# EAGLE design Trimble Thunderbolt Monitor Shield v1.1 (EAGLE 6.5.0)
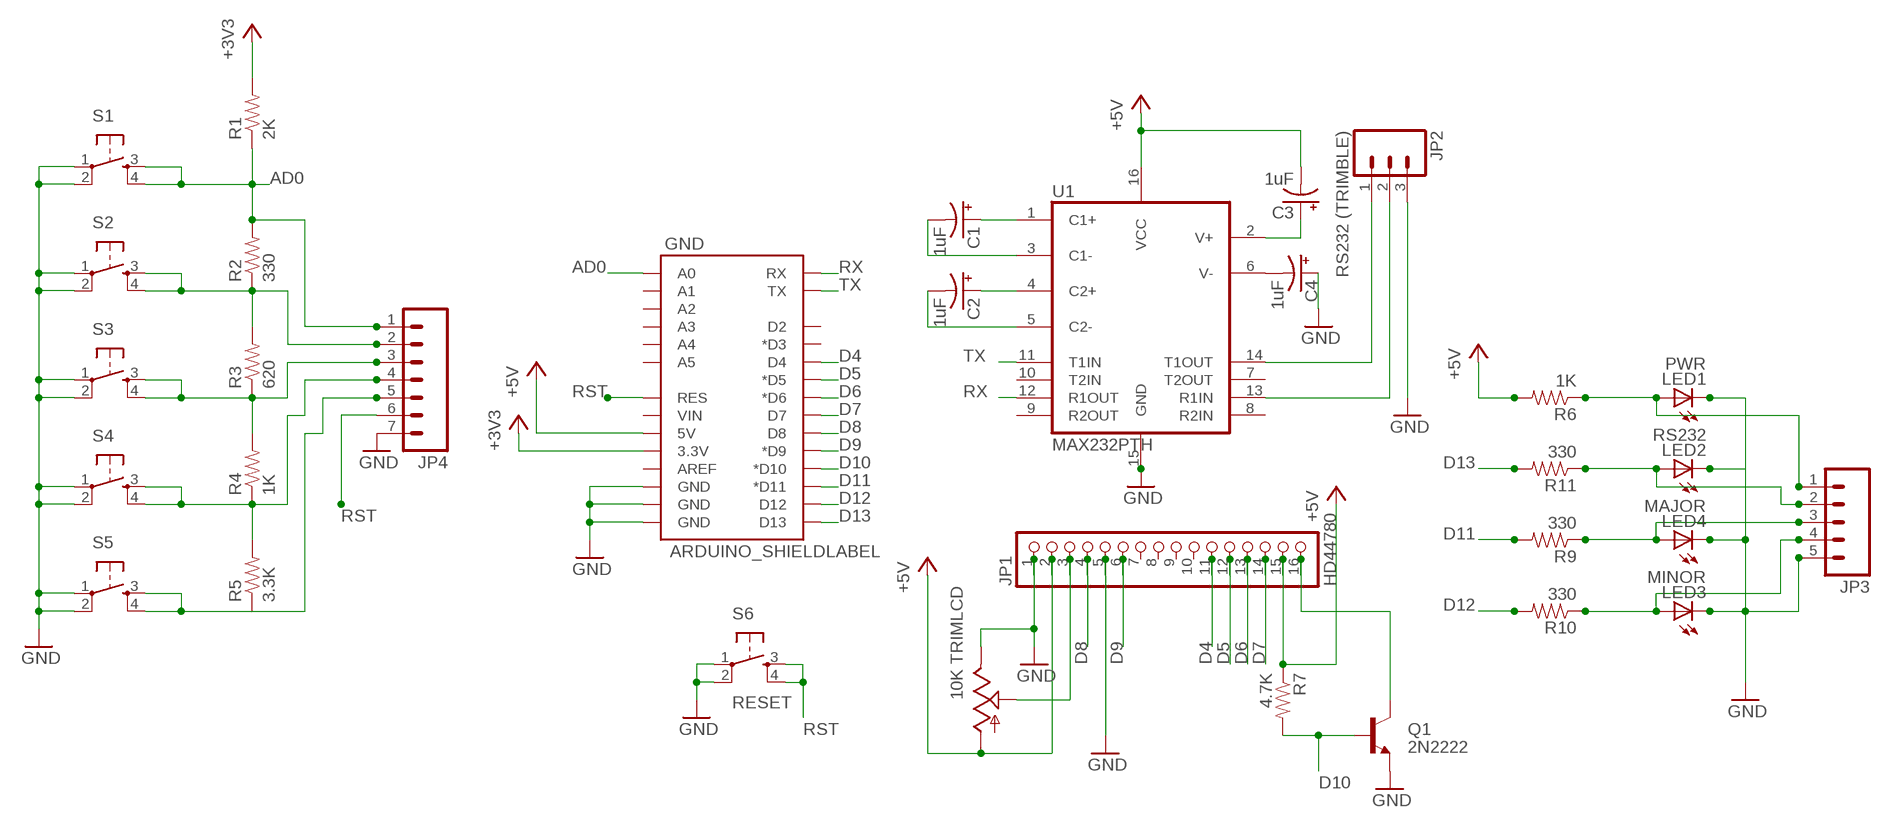
[diagram p0: schematic, sheet 1]

## Parts
C1  1uF  CAP_POLPTH2  [CPOL-RADIAL-10UF-25V]
C2  1uF  CAP_POLPTH2  [CPOL-RADIAL-10UF-25V]
C3  1uF  CAP_POLPTH2  [CPOL-RADIAL-10UF-25V]
C4  1uF  CAP_POLPTH2  [CPOL-RADIAL-10UF-25V]
GND  ARDUINO_SHIELDLABEL  [DUEMILANOVE_SHIELD]
JP1  HD44780  PINHD-1X16  [1X16]
JP2  RS232 (TRIMBLE)  M03POLAR  [MOLEX-1X3]
JP3  M05PTH  [1X05]
JP4  M07  [1X07]
LED1  PWR  LED5MM  [LED5MM]
LED2  RS232  LED5MM  [LED5MM]
LED3  MINOR  LED5MM  [LED5MM]
LED4  MAJOR  LED5MM  [LED5MM]
Q1  2N2222  TRANSISTOR_NPNTO-92-AMMO  [TO-92-AMMO]
R1  2K  RESISTORAXIAL-0.3  [AXIAL-0.3]
R2  330  RESISTORAXIAL-0.3  [AXIAL-0.3]
R3  620  RESISTORAXIAL-0.3  [AXIAL-0.3]
R4  1K  RESISTORAXIAL-0.3  [AXIAL-0.3]
R5  3.3K  RESISTORAXIAL-0.3  [AXIAL-0.3]
R6  1K  RESISTORAXIAL-0.3  [AXIAL-0.3]
R7  4.7K  RESISTORAXIAL-0.3  [AXIAL-0.3]
R9  330  RESISTORAXIAL-0.3  [AXIAL-0.3]
R10  330  RESISTORAXIAL-0.3  [AXIAL-0.3]
R11  330  RESISTORAXIAL-0.3  [AXIAL-0.3]
S1  TAC_SWITCHPTH  [TACTILE-PTH]
S2  TAC_SWITCHPTH  [TACTILE-PTH]
S3  TAC_SWITCHPTH  [TACTILE-PTH]
S4  TAC_SWITCHPTH  [TACTILE-PTH]
S5  TAC_SWITCHPTH  [TACTILE-PTH]
S6  RESET  TAC_SWITCHPTH  [TACTILE-PTH]
TRIMLCD  10K  POT100K_3362U  [3362U]
U1  MAX232PTH  [DIL16]

## Nets
+3V3: GND.3.3V R1.P$2
+5V: C3.2(-) GND.5V JP1.2 JP1.15 R6.P$2 R7.P$1 TRIMLCD.P$3(A) U1.16(VCC)
AD0: GND.A0 JP4.1 R1.P$1 R2.P$2 S1.3 S1.4
D4: GND.D4 JP1.11
D5: GND.D5(*D5) JP1.12
D6: GND.D6(*D6) JP1.13
D7: GND.D7 JP1.14
D8: GND.D8 JP1.4
D9: GND.D9(*D9) JP1.6
D10: GND.D10(*D10) Q1.2(B) R7.P$2
D11: GND.D11(*D11) R9.P$2
D12: GND.D12 R10.P$2
D13: GND.D13 R11.P$2
GND: C4.1(+) GND.GND@0(GND) GND.GND@1(GND) GND.GND@2(GND) JP1.1 JP1.5 JP2.3 JP3.5 JP4.7 LED1.K(C) LED2.K(C) LED3.K(C) LED4.K(C) Q1.1(E) S1.1 S1.2 S2.1 S2.2 S3.1 S3.2 S4.1 S4.2 S5.1 S5.2 S6.1 S6.2 TRIMLCD.P$1(E) U1.15(GND)
LEDRS232: JP3.2 LED2.A R11.P$1
N$1: JP4.3 R3.P$1 R4.P$2 S3.3 S3.4
N$2: JP3.3 LED4.A R9.P$1
N$3: JP4.4 R4.P$1 R5.P$2 S4.3 S4.4
N$4: JP3.1 LED1.A R6.P$1
N$5: JP4.5 R5.P$1 S5.3 S5.4
N$6: JP2.1 U1.14(T1OUT)
N$7: JP1.16 Q1.3(C)
N$8: JP1.3 TRIMLCD.P$2(S)
N$9: JP2.2 U1.13(R1IN)
N$10: C1.2(-) U1.3(C1-)
N$13: C1.1(+) U1.1(C1+)
N$14: C2.1(+) U1.4(C2+)
N$15: C2.2(-) U1.5(C2-)
N$16: C4.2(-) U1.6(V-)
N$17: C3.1(+) U1.2(V+)
N$18: JP3.4 LED3.A R10.P$1
N$20: JP4.2 R2.P$1 R3.P$2 S2.3 S2.4
RST: GND.RES JP4.6 S6.3 S6.4
RX: GND.RX U1.12(R1OUT)
TX: GND.TX U1.11(T1IN)
Unconnected: GND.A1 GND.A2 GND.A3 GND.A4 GND.A5 GND.AREF GND.D2 GND.D3(*D3) GND.VIN JP1.7 JP1.8 JP1.9 JP1.10 U1.7(T2OUT) U1.8(R2IN) U1.9(R2OUT) U1.10(T2IN)

## Library data of the parts
C1-C4 = SparkFun:CAP_POL: Capacitor Polarized These are standard SMD and PTH capacitors. Normally 10uF, 47uF, and 100uF in electrolytic and tantalum varieties. Always verify the external diameter of the through hole cap, it varies with capacity, voltage, and manufacturer. The EIA devices should be standard.
GND = SparkFun:ARDUINO_SHIELD
JP1 = pinhead:PINHD-1X16: PIN HEADER
JP2 = SparkFun:M03: Header 3 Standard 3-pin 0.1" header. Use with straight break away headers (SKU : PRT-00116), right angle break away headers (PRT-00553), swiss pins (PRT-00743), machine pins (PRT-00117), and female headers (PRT-00115). Molex polarized connector foot print use with SKU : PRT-08232 with associated crimp pins and housings.
JP3 = SparkFun:M05: Header 5 Standard 5-pin 0.1" header. Use with straight break away headers (SKU : PRT-00116), right angle break away headers (PRT-00553), swiss pins (PRT-00743), machine pins (PRT-00117), and female headers (PRT-00115). Molex polarized connector foot print use with SKU : PRT-08230 with associated crimp pins and housings.
JP4 = SparkFun:M07: Header 7 Standard 7-pin 0.1" header. Use with straight break away headers (SKU : PRT-00116), right angle break away headers (PRT-00553), swiss pins (PRT-00743), machine pins (PRT-00117), and female headers (PRT-00115). NOTES ON THE VARIANTS LOCK and LOCK_LONGPADS... This footprint was designed to help hold the alignment of a through-hole component (i.e. 7-pin header) while soldering it into place. You may notice that each hole has been shifted either up or down by 0.005 of an inch from it's more standard position (which is usually a perfectly straight line). This slight alteration caused the pins (the squares in the middle) to touch the edges of the holes. Because they are alternating, it causes a "brace" to hold the header in place. 0.005 has proven to be the perfect amount of "off-center" position when using our standard breakaway headers. Although looks a little odd when you look at the bare footprint, once you have a header in there, the alteration is very hard to notice. Also, if you push a header all the way into place, it is covered up entirely on the bottom side. This idea of altering the position of holes to aid alignment will be further integrated into the Sparkfun Library for other footprints. It can help hold any component with 3 or more connection pins.
LED1-LED4 = led:LED: LED OSRAM: - CHIPLED LG R971, LG N971, LY N971, LG Q971, LY Q971, LO R971, LY R971 LH N974, LH R974 LS Q976, LO Q976, LY Q976 LO Q996 - Hyper CHIPLED LW Q18S LB Q993, LB Q99A, LB R99A - SideLED LS A670, LO A670, LY A670, LG A670, LP A670 LB A673, LV A673, LT A673, LW A673 LH A674 LY A675 LS A676, LA A676, LO A676, LY A676, LW A676 LS A679, LY A679, LG A679 - Hyper Micro SIDELED® LS Y876, LA Y876, LO Y876, LY Y876 LT Y87S - SmartLED LW L88C, LW L88S LB L89C, LB L89S, LG L890 LS L89K, LO L89K, LY L89K LS L896, LA L896, LO L896, LY L896 - TOPLED LS T670, LO T670, LY T670, LG T670, LP T670 LSG T670, LSP T670, LSY T670, LOP T670, LYG T670 LG T671, LOG T671, LSG T671 LB T673, LV T673, LT T673, LW T673 LH T674 LS T676, LA T676, LO T676, LY T676, LB T676, LH T676, LSB T676, LW T676 LB T67C, LV T67C, LT T67C, LS T67K, LO T67K, LY T67K, LW E67C LS E67B, LA E67B, LO E67B, LY E67B, LB E67C, LV E67C, LT E67C LW T67C LS T679, LY T679, LG T679 LS T770, LO T770, LY T770, LG T770, LP T770 LB T773, LV T773, LT T773, LW T773 LH T774 LS E675, LA E675, LY E675, LS T675 LS T776, LA T776, LO T776, LY T776, LB T776 LHGB T686 LT T68C, LB T68C - Hyper Mini TOPLED® LB M676 - Mini TOPLED Santana® LG M470 LS M47K, LO M47K, LY M47K Source: http://www.osram.convergy.de LUXEON: - LUMILED® LXK2-PW12-R00, LXK2-PW12-S00, LXK2-PW14-U00, LXK2-PW14-V00 LXK2-PM12-R00, LXK2-PM12-S00, LXK2-PM14-U00 LXK2-PE12-Q00, LXK2-PE12-R00, LXK2-PE12-S00, LXK2-PE14-T00, LXK2-PE14-U00 LXK2-PB12-K00, LXK2-PB12-L00, LXK2-PB12-M00, LXK2-PB14-N00, LXK2-PB14-P00, LXK2-PB14-Q00 LXK2-PR12-L00, LXK2-PR12-M00, LXK2-PR14-Q00, LXK2-PR14-R00 LXK2-PD12-Q00, LXK2-PD12-R00, LXK2-PD12-S00 LXK2-PH12-R00, LXK2-PH12-S00 LXK2-PL12-P00, LXK2-PL12-Q00, LXK2-PL12-R00 Source: www.luxeon.com KINGBRIGHT: KA-3528ASYC Source: www.kingbright.com
Q1 = SparkFun:TRANSISTOR_NPN: Transistor NPN BJT configuration in SOT23 package. MMBT2222 is the common NPN we use. Double check BCE configuration again layout.
R1-R7 R9-R11 = SparkFun:RESISTOR: Resistor Basic schematic elements and footprints for 0603, 1206, and PTH resistors.
S1-S6 = SparkFun:TAC_SWITCH: Momentary Switch Button commonly used for reset or general input. Spark Fun Electronics SKU : COM-00097
TRIMLCD = SparkFun:POT
U1 = SparkFun:MAX232: RS232 Transceiver Very common IC. This is generically called 'MAX232', but works with the 3V equivalent MAX3232 generic ICs. Field tested and mother approved. Spark Fun Electronics SKU : COM-00316 (DIP) and COM-00589 (SMD)

## Board
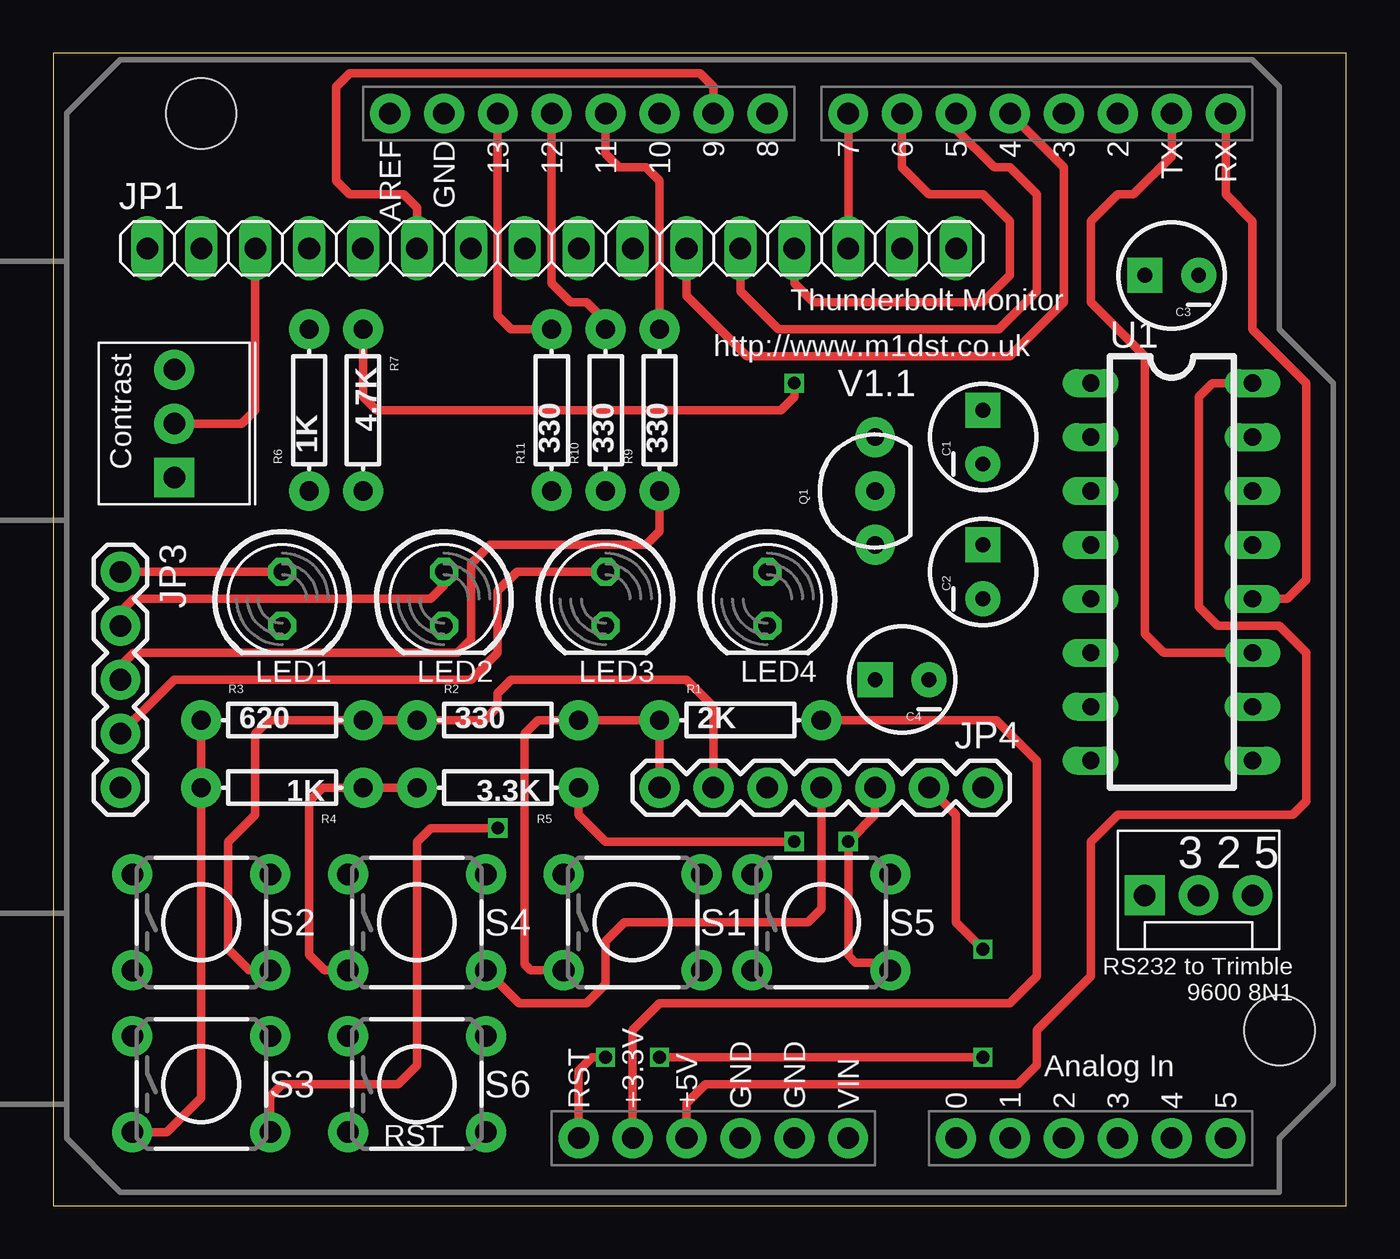
[diagram p1: board, top side]
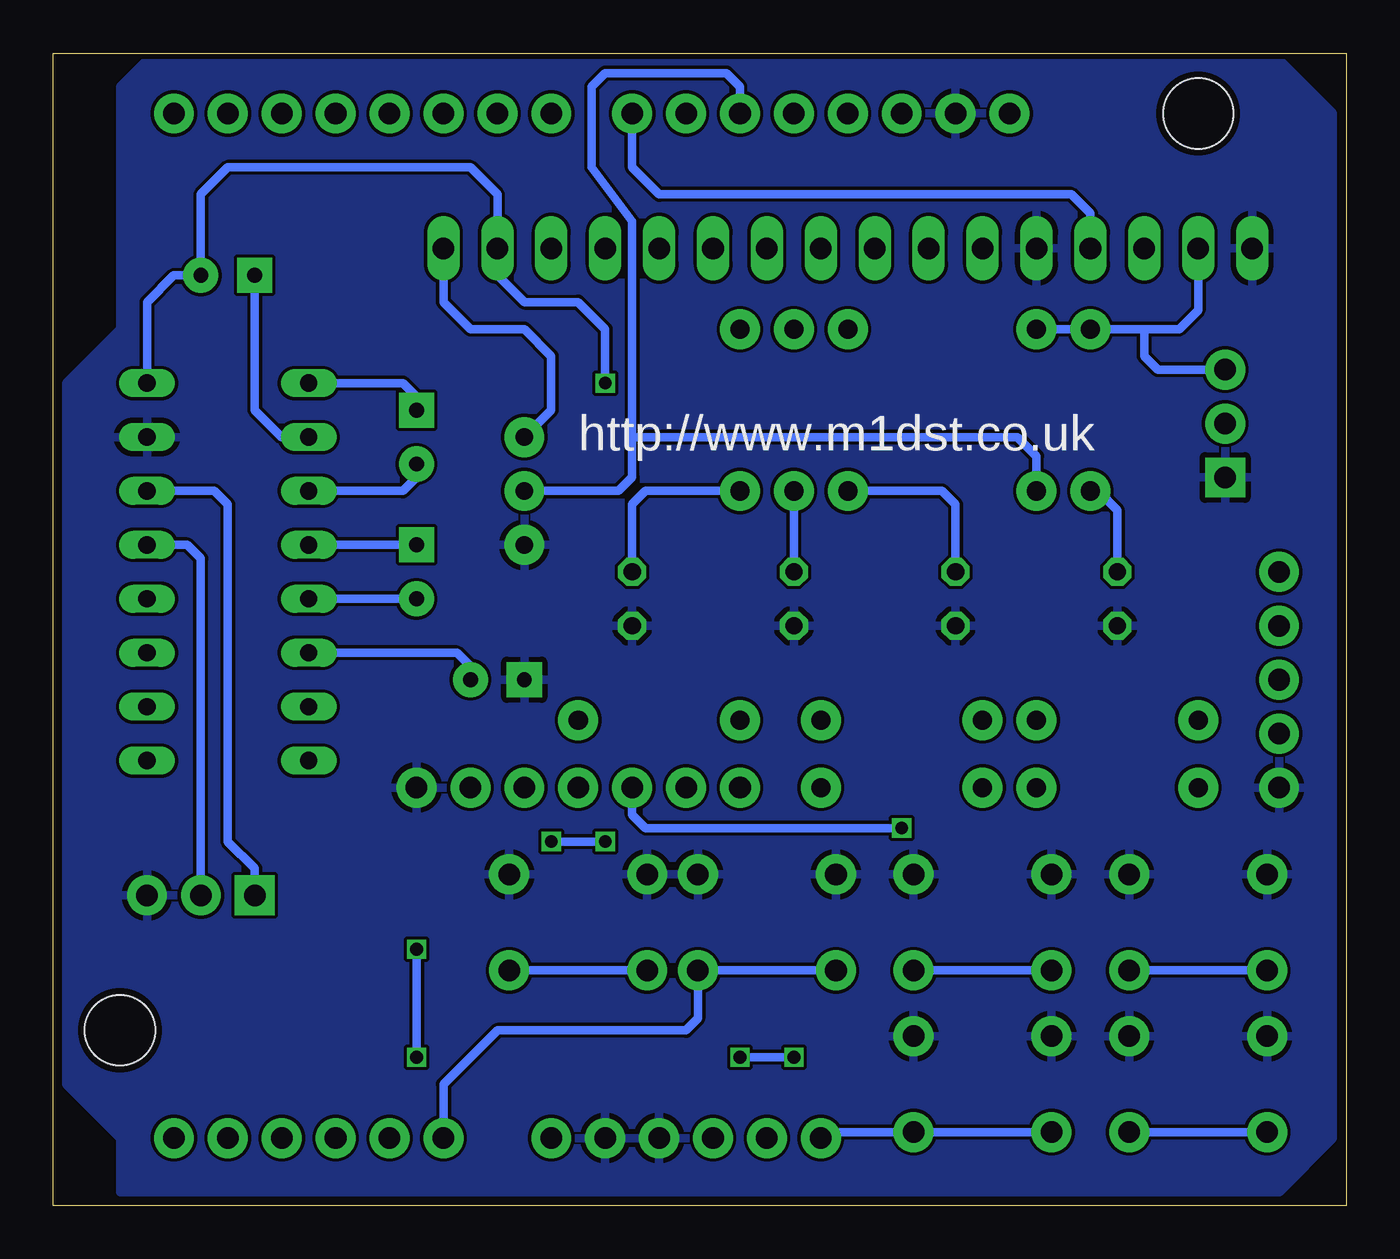
[diagram p2: board, bottom side, seen from below]

Size 60.94 x 54.28 mm. Coordinates in mm from the lower left corner, seen from the top.
Outline: 0,0 60.94,0 60.94,54.28 0,54.28 0,0
Copper layers (1*16): Top 0.035mm / dielectric 1.5mm / Bottom 0.035mm
Design rules "ITead_rule": minimum track width 6mil, minimum drill 12mil, track to track 6mil, track to pad 6mil, pad to pad 6mil, via to via 6mil, smd to smd 0mil, copper to edge 10mil, drill to drill 10mil, minimum pad ring 10mil, minimum via ring 6mil, stop-mask expansion 2mil, vias tented up to drill 100mil, thermal gap 10mil

### Footprints (pad centres in the part's own frame; a part is rotated, then mirrored left to right if it is on the bottom)
CPOL-RADIAL-10UF-25V = drill 0.7 pad 1.651 square: 1 1.27,0 | drill 0.7 pad 1.651: 2 -1.27,0
DUEMILANOVE_SHIELD = drill 1.016 pad 1.88: 3.3V 50.8,26.67; 5V 50.8,29.21; A0 50.8,41.91; A1 50.8,44.45; A2 50.8,46.99; A3 50.8,49.53; A4 50.8,52.07; A5 50.8,54.61; AREF 2.54,15.24; D2 2.54,49.53; D3 2.54,46.99; D4 2.54,44.45; D5 2.54,41.91; D6 2.54,39.37; D7 2.54,36.83; D8 2.54,33.02; D9 2.54,30.48; D10 2.54,27.94; D11 2.54,25.4; D12 2.54,22.86; D13 2.54,20.32; GND@0 50.8,31.75; GND@1 50.8,34.29; GND@2 2.54,17.78; RES 50.8,24.13; RX 2.54,54.61; TX 2.54,52.07; VIN 50.8,36.83 | hole 3.302: 45.72,57.15; 2.54,6.35
1X16 = drill 1.016 long: 1 -19.05,0; 2 -16.51,0; 3 -13.97,0; 4 -11.43,0; 5 -8.89,0; 6 -6.35,0; 7 -3.81,0; 8 -1.27,0; 9 1.27,0; 10 3.81,0; 11 6.35,0; 12 8.89,0; 13 11.43,0; 14 13.97,0; 15 16.51,0; 16 19.05,0
MOLEX-1X3 = drill 1.016 pad 1.88 square: 1 0,0 | drill 1.016 pad 1.88: 2 2.54,0; 3 5.08,0
1X05 = drill 1.016 pad 1.88: 1 0,0; 2 2.54,0; 3 5.08,0; 4 7.62,0; 5 10.16,0
1X07 = drill 1.016 pad 1.88: 1 0,0; 2 2.54,0; 3 5.08,0; 4 7.62,0; 5 10.16,0; 6 12.7,0; 7 15.24,0
LED5MM = drill 0.813 octagon: A -1.27,0; K 1.27,0
TO-92-AMMO = drill 0.813 pad 1.88: 1 -2.54,0; 2 0,0; 3 2.54,0
AXIAL-0.3 = drill 0.9 pad 1.88: P$1 -3.81,0; P$2 3.81,0
TACTILE-PTH = drill 1.016 pad 1.88: 1 -3.251,2.261; 2 3.251,2.261; 3 -3.251,-2.261; 4 3.251,-2.261
3362U = drill 1.016 pad 1.88 square: P$1 0,2.54 | drill 1.016 pad 1.88: P$2 2.54,2.54; P$3 5.08,2.54
DIL16 = drill 0.813 long: 1 -8.89,-3.81; 2 -6.35,-3.81; 3 -3.81,-3.81; 4 -1.27,-3.81; 5 1.27,-3.81; 6 3.81,-3.81; 7 6.35,-3.81; 8 8.89,-3.81; 9 8.89,3.81; 10 6.35,3.81; 11 3.81,3.81; 12 1.27,3.81; 13 -1.27,3.81; 14 -3.81,3.81; 15 -6.35,3.81; 16 -8.89,3.81

### Placement (x,y rotation side)
C1  43.82,36.2 90 top
C2  43.82,29.84 90 top
C3  52.71,43.81 180 top
C4  40,24.77 180 top
GND  0.63,53.97 270 top
JP1  23.49,45.08 0 top
JP2  51.43,14.61 0 top
JP3  3.17,29.84 270 top
JP4  28.57,19.69 0 top
LED1  10.8,28.58 270 top
LED2  18.41,28.58 270 top
LED3  26.03,28.58 270 top
LED4  33.66,28.58 270 top
Q1  38.73,33.66 90 top
R1  32.38,22.86 0 top
R2  20.95,22.86 0 top
R3  10.8,22.86 0 top
R4  10.8,19.69 180 top
R5  20.95,19.69 180 top
R6  12.06,37.47 90 top
R7  14.6,37.47 270 top
R9  28.57,37.47 90 top
R10  26.03,37.47 90 top
R11  23.49,37.47 90 top
S1  27.3,13.34 0 top
S2  6.98,13.34 0 top
S3  6.98,5.72 0 top
S4  17.14,13.34 0 top
S5  36.2,13.34 0 top
S6  17.14,5.72 0 top
TRIMLCD  8.25,34.29 90 top
U1  52.71,29.84 270 top

### Tracks (layer width: path | path; a pad name or v marks a point on that pad's centre or on a via)
+3V3
  Top 0.406: GND.3.3V 27.3,8.26 28.57,9.52 45.09,9.52 46.35,10.8 46.35,20.95 44.45,22.86 R1.P$2
+5V  (via drill 0.6)
  Top 0.406: GND.5V 29.84,4.82 30.74,5.72 45.46,5.72 46.35,6.61 46.35,8.26 47.62,9.52 48.9,10.8 48.9,17.15 50.16,18.41 58.42,18.41 59.05,19.05 59.05,26.03 57.79,27.31 54.87,27.31 53.98,28.2 53.98,38.1 54.61,38.73 U1.16 | v34.92,38.73 34.92,38.1 34.29,37.47 15.24,37.47 14.6,38.1 R7.P$1
  Bottom 0.406: 9.52,41.28 R6.P$2 R7.P$1 | v34.92,38.73 34.92,41.28 36.2,42.55 38.73,42.55 40,43.81 JP1.15 40,47.62 41.27,48.89 52.71,48.89 53.98,47.62 C3.2 55.24,43.81 56.51,42.55 U1.16 | TRIMLCD.P$3 8.89,39.37 9.52,40 9.52,41.28 | JP1.2 6.98,42.17 7.88,41.28 9.52,41.28
AD0
  Top 0.406: S1.3 22.5,11.07 22.23,11.35 22.23,22.23 22.86,22.86 R2.P$2 R1.P$1 JP4.1
  Bottom 0.406: GND.A0 42.54,5.72 40,8.26 31.12,8.26 30.56,8.81 S1.4 S1.3
D4
  Top 0.406: JP1.11 29.84,42.84 32.68,40 45.09,40 47.62,42.55 47.62,48.89 GND.D4
D5
  Top 0.406: JP1.12 32.38,43.07 34.18,41.28 44.56,41.28 46.35,43.07 46.35,47.62 45.09,48.89 44.34,48.89 42.54,50.69 GND.D5
D6
  Top 0.406: JP1.13 34.92,43.44 35.82,42.55 43.82,42.55 45.09,43.81 45.09,46.36 43.82,47.62 41.27,47.62 40,48.89 GND.D6
D7
  Top 0.406: JP1.14 GND.D7
D8
  Bottom 0.406: JP1.4 12.06,46.73 12.96,47.62 32.38,47.62 33.66,48.89 GND.D8
D9
  Top 0.406: JP1.6 17.14,46.99 16.51,47.62 13.97,47.62 13.34,48.26 13.34,52.7 13.97,53.34 30.48,53.34 31.12,52.7 GND.D9
D10
  Bottom 0.406: R7.P$2 14.6,35.3 15.5,36.2 33.66,36.2 | GND.D10 28.57,52.7 29.21,53.34 34.92,53.34 35.56,52.7 35.56,48.89 33.66,46.36 33.66,36.2 | Q1.2 34.29,33.66 33.66,34.29 33.66,36.2
D11
  Top 0.406: GND.D11 26.03,49.53 26.67,48.89 27.94,48.89 28.57,48.26 R9.P$2
D12
  Top 0.406: GND.D12 23.49,43.44 24.39,42.55 25.14,42.55 26.03,41.65 R10.P$2
D13
  Top 0.406: GND.D13 20.95,41.91 21.59,41.28 R11.P$2
GND
  pour Bottom: 3.17,53.97 0.63,51.44 0.63,3.17 3.17,0.63 57.79,0.63 57.79,3.17 60.32,5.72 60.32,38.73 57.79,41.28 57.79,52.7 56.51,53.97
LEDRS232
  Top 0.406: JP3.2 3.17,27.94 3.81,28.58 17.78,28.58 18.41,29.21 LED2.A
  Bottom 0.406: R11.P$1 19.05,33.66 18.41,33.02 LED2.A
N$1  (via drill 0.6)
  Top 0.406: R3.P$1 R4.P$2 6.98,5.08 5.36,3.45 S3.3 | S3.4 10.24,5.16 10.8,5.72 16.25,5.72 17.14,6.61 17.14,17.15 17.78,17.78 v20.95,17.78
  Bottom 0.406: S3.3 S3.4 | v20.95,17.78 33.02,17.78 33.66,18.41 JP4.3
N$2
  Top 0.406: JP3.3 3.17,25.4 3.81,26.03 19.05,26.03 19.68,26.67 19.68,30.22 20.58,31.11 27.94,31.11 28.57,31.75 R9.P$1
  Bottom 0.406: R9.P$1 33.02,33.66 33.66,33.02 LED4.A
N$3
  Top 0.406: R5.P$2 R4.P$1 12.7,19.69 12.06,19.05 12.06,11.8 12.79,11.07 S4.3 | JP4.4 36.2,13.97 35.56,13.34 26.93,13.34 26.03,12.44 26.03,10.42 25.14,9.52 21.95,9.52 S4.4
  Bottom 0.406: S4.3 S4.4
N$4
  Top 0.406: JP3.1 LED1.A
  Bottom 0.406: R6.P$1 11.69,33.66 10.8,32.76 LED1.A
N$5  (via drill 0.6)
  Top 0.406: R5.P$1 24.77,18.41 26.03,17.15 v34.92,17.15 | S5.4 39.08,11.44 37.81,11.44 37.46,11.79 v37.46,17.15 38.73,18.41 JP4.5
  Bottom 0.406: S5.3 S5.4 | v34.92,17.15 v37.46,17.15
N$6
  Bottom 0.406: U1.14 53.34,33.66 52.71,33.02 52.71,17.15 51.43,15.88 JP2.1
N$7
  Bottom 0.406: JP1.16 42.54,42.55 41.27,41.28 38.73,41.28 37.46,40 37.46,37.47 Q1.3
N$8
  Top 0.406: JP1.3 9.52,37.47 8.89,36.83 TRIMLCD.P$2
N$9
  Bottom 0.406: JP2.2 53.98,30.48 54.61,31.11 U1.13
N$10
  Bottom 0.406: C1.2 43.82,34.29 44.45,33.66 U1.3
N$13
  Bottom 0.406: C1.1 43.82,38.1 44.45,38.73 U1.1
N$14
  Bottom 0.406: C2.1 U1.4
N$15
  Bottom 0.406: C2.2 U1.5
N$16
  Bottom 0.406: C4.2 41.27,25.4 41.91,26.03 U1.6
N$17
  Bottom 0.406: U1.2 50.16,36.2 51.43,37.47 C3.1
N$18
  Top 0.406: JP3.4 5.71,24.77 19.68,24.77 20.95,26.03 20.95,28.95 21.85,29.84 LED3.A
  Bottom 0.406: LED3.A R10.P$1
N$20
  Top 0.406: JP4.2 31.12,23.49 29.84,24.77 21.59,24.77 20.95,24.13 20.95,23.49 20.32,22.86 R2.P$1 R3.P$2 10.16,22.86 9.52,22.23 9.52,18.41 8.25,17.15 8.25,12.06 9.25,11.07 S2.4
  Bottom 0.406: S2.3 S2.4
RST  (via drill 0.6)
  Top 0.406: v43.82,6.98 v28.57,6.98 | GND.RES 24.77,6.35 25.4,6.98 v26.03,6.98 | JP4.6 42.54,18.41 42.54,13.34 v43.82,12.06
  Bottom 0.406: S6.3 S6.4 24.49,3.45 GND.RES | v26.03,6.98 v28.57,6.98 | v43.82,12.06 v43.82,6.98
RX
  Top 0.406: GND.RX 55.24,47.62 56.51,46.36 56.51,41.28 59.05,38.73 59.05,29.47 58.16,28.58 U1.12
TX
  Top 0.406: U1.11 52.33,26.03 51.43,26.93 51.43,40 48.9,42.55 48.9,46.36 50.16,47.62 50.91,47.62 52.71,49.42 GND.TX

### Text on the board
tPlace: Thunderbolt Monitor | Contrast | http://www.m1dst.co.uk | V1.1 | 3 2 5 | RS232 to Trimble / 9600 8N1 | RST
bPlace: http://www.m1dst.co.uk